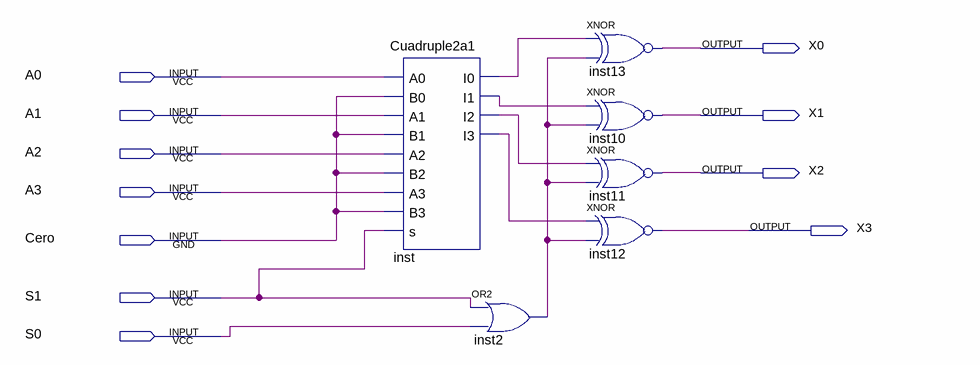
[diagram p0: schematic sheet]
// Quartus schematic BloqueX.bdf as structural Verilog: 6 symbols, 11 pins
module BloqueX (
  input  A0,
  input  A1,
  input  A2,
  input  A3,
  input  Cero,
  input  S1,
  input  S0,
  output X0,
  output X1,
  output X2,
  output X3
);

  wire inst2_out, inst_i0, inst_i1, inst_i2, inst_i3;

  Cuadruple2a1 inst (
    .A0(A0), .B0(Cero), .A1(A1), .B1(Cero), .A2(A2), .B2(Cero), .A3(A3), .B3(Cero), .s(S1), .I0(inst_i0),
    .I1(inst_i1), .I2(inst_i2), .I3(inst_i3));
  or inst2 (inst2_out, S1, S0);
  xnor inst13 (X0, inst_i0, inst2_out);
  xnor inst10 (X1, inst_i1, inst2_out);
  xnor inst11 (X2, inst_i2, inst2_out);
  xnor inst12 (X3, inst_i3, inst2_out);
endmodule
